# Altium schematic sheet LCD_PCB_schemetic_1.SchDoc
size A4; SheetNumber: 1; SheetTotal: 1
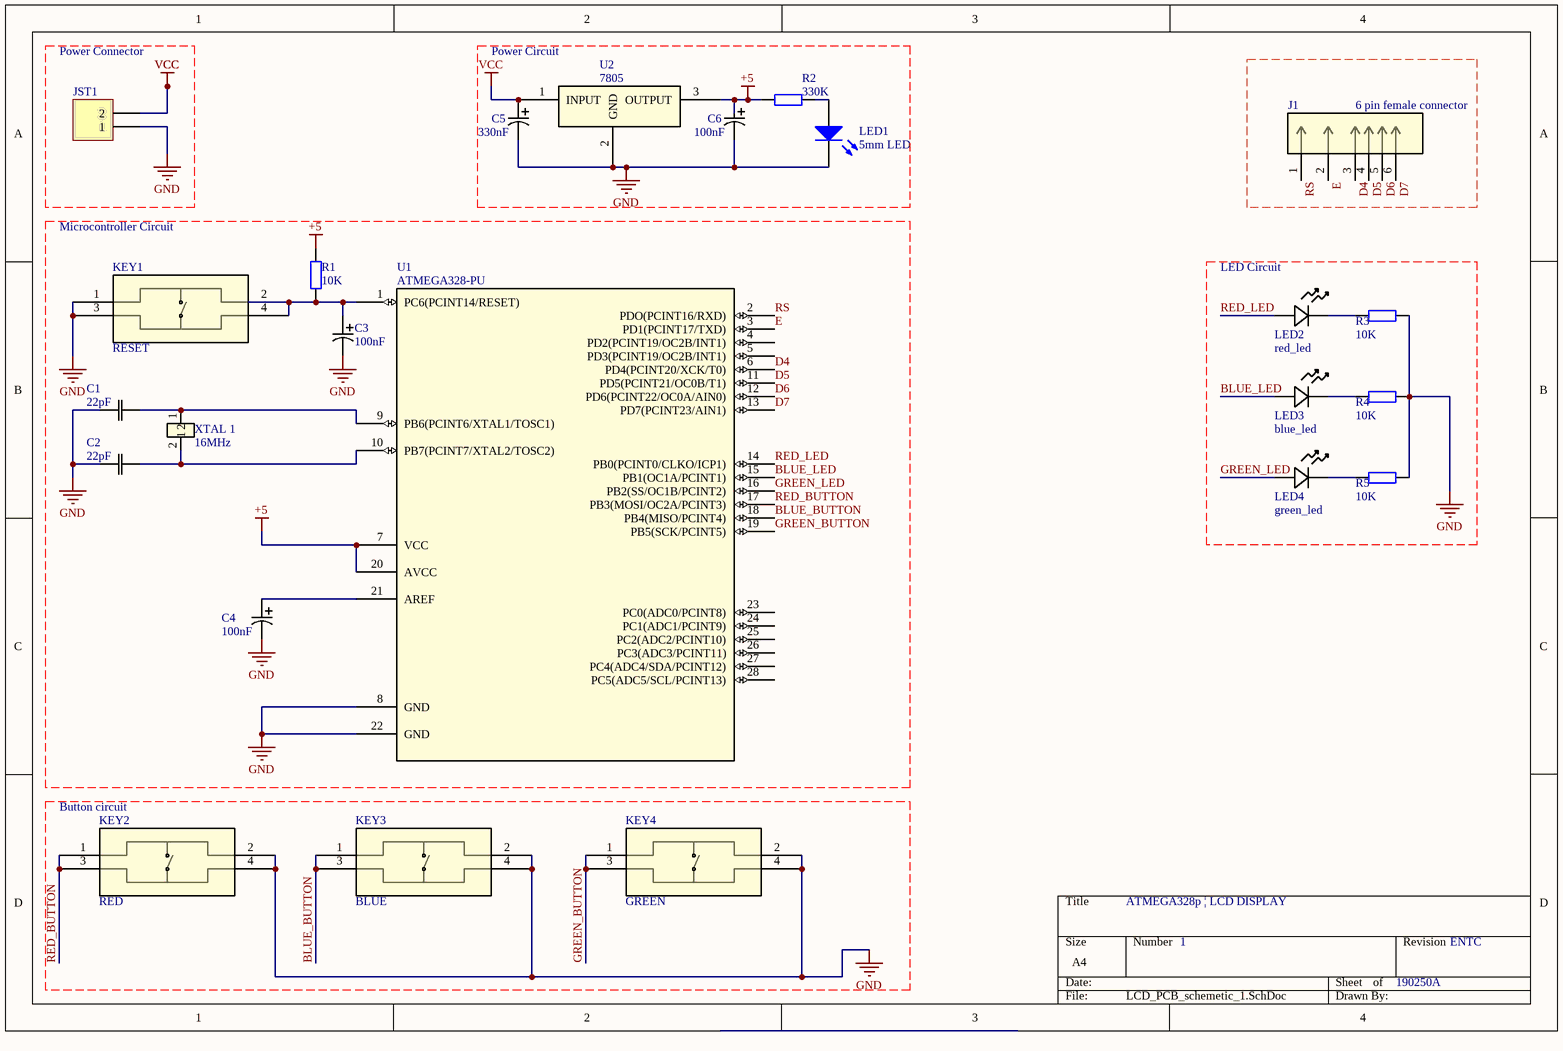
[diagram p0: LCD_PCB_schemetic_1.SchDoc]

## Parts
C1  22pF  [CAP_K220J15C0GF53L2_VIS]
C2  22pF  [CAP_K220J15C0GF53L2_VIS]
C3  100nF  [PCAP_10x16_PAN]
C4  100nF  [PCAP_10x16_PAN]
C5  330nF  [PCAP_10x16_PAN]
C6  100nF  [PCAP_10x16_PAN]
J1  6 pin female connector  [CONN6_1744055-6]
JST1  (no value)  [MHDR1X2]
KEY1  RESET  [TL1100F]
KEY2  RED  [TL1100F]
KEY3  BLUE  [TL1100F]
KEY4  GREEN  [TL1100F]
LED1  5mm LED  [LED-0]
LED2  red_led  [LED_SSL-LX5093BID_LUM]
LED3  blue_led  [LED_SSL-LX5093BID_LUM]
LED4  green_led  [LED_SSL-LX5093BID_LUM]
R1  10K  [AXIAL-0.4]
R2  330K  [AXIAL-0.4]
R3  10K  [AXIAL-0.4]
R4  10K  [AXIAL-0.4]
R5  10K  [AXIAL-0.4]
U1  ATMEGA328-PU  [28P3_SPDIP28_SP_MCH]
U2  7805  [TO-220_FAS]
XTAL_1  16MHz  [SMD_ABLS_11P4X4P7_ABR]

## Nets
+5: C6.1 R1.2 R2.1 U1.7(VCC) U1.20(AVCC) U2.3(OUTPUT)
GND: C1.2 C2.2 C3.2 C4.2 C5.2 C6.2 JST1.1 KEY1.1 KEY1.3 KEY2.2 KEY2.4 KEY3.2 KEY3.4 KEY4.2 KEY4.4 LED1.2(K) R3.1 R4.1 R5.1 U1.8(GND) U1.22(GND) U2.2(GND)
VCC: C5.1 JST1.2 U2.1(INPUT)
BLUE_BUTTON: KEY3.1 KEY3.3 U1.18(PB4(MISO/PCINT4))
BLUE_LED: LED3.2 U1.15(PB1(OC1A/PCINT1))
D4: J1.3 U1.6(PD4(PCINT20/XCK/T0))
D5: J1.4 U1.11(PD5(PCINT21/OC0B/T1))
D6: J1.5 U1.12(PD6(PCINT22/OC0A/AIN0))
D7: J1.6 U1.13(PD7(PCINT23/AIN1))
E: J1.2 U1.3(PD1(PCINT17/TXD))
GREEN_BUTTON: KEY4.1 KEY4.3 U1.19(PB5(SCK/PCINT5))
GREEN_LED: LED4.2 U1.16(PB2(SS/OC1B/PCINT2))
RED_BUTTON: KEY2.1 KEY2.3 U1.17(PB3(MOSI/OC2A/PCINT3))
RED_LED: LED2.2 U1.14(PB0(PCINT0/CLKO/ICP1))
RS: J1.1 U1.2(PDO(PCINT16/RXD))
NetC1_1: C1.1 U1.9(PB6(PCINT6/XTAL1/TOSC1)) XTAL_1.1
NetC2_1: C2.1 U1.10(PB7(PCINT7/XTAL2/TOSC2)) XTAL_1.2
NetC3_1: C3.1 KEY1.2 KEY1.4 R1.1 U1.1(PC6(PCINT14/RESET))
NetC4_1: C4.1 U1.21(AREF)
NetLED1_1: LED1.1(A) R2.2
NetLED2_1: LED2.1 R3.2
NetLED3_1: LED3.1 R4.2
NetLED4_1: LED4.1 R5.2

Not connected (* = marked no-connect by the designer): U1 4(PD2(PCINT19/OC2B/INT1)) 5(PD3(PCINT19/OC2B/INT1)) 23(PC0(ADC0/PCINT8)) 24(PC1(ADC1/PCINT9)) 25(PC2(ADC2/PCINT10)) 26(PC3(ADC3/PCINT11)) 27(PC4(ADC4/SDA/PCINT12)) 28(PC5(ADC5/SCL/PCINT13))

## Notes on the sheet
- Power Connector
- Power Circuit
- Microcontroller Circuit
- (near LED2) LED Circuit
- (near KEY2) Button circuit
- ATMEGA328p | LCD DISPLAY
- 1
- 190250A
- ENTC

## Library data of the parts
C1 C2 = K220J15C0GF53L2: No Description Available; Vendor: Vishay; Built_By: EMA_Cory; SourceLibrary: Vishay_2020-06-24; Type: DEV; Datasheet: https://www.mouser.com/datasheet/2/427/kseries-1763315.pdf; Manufacturer_Part_Number: K220J15C0GF53L2; Copyright: Copyright (C) 2018 Accelerated Designs. All rights reserved; RefDes: RefDes
C3-C6 = ECA2GM4R7: No Description Available; Vendor: Panasonic; Built_By: EMA_UL_Team; SourceLibrary: Panasonic_2011-12-05_Caps_NHG; Type: DEV; Manufacturer_Part_Number: ECA2GM4R7; Copyright: Copyright (C) 2018 Accelerated Designs. All rights reserved; RefDes: RefDes
J1 = 1744055-6: 3.96 EP HDR ASSY 6P VERT HT; Vendor: TE Connectivity; Built_By: EMA_UL_Team; ROWS/CONFIG: 1; PITCH(MM): 3.96; POSITIONS: 6; SourceLibrary: TE_Connectivity_250_Part_Delivery_6_2018-09-18; Copyright: Copyright (C) 2016 Accelerated Designs. All rights reserved; Manufacturer_Part_Number: 1744055-6; TE_Part_Number: 1744055-6; PRODUCT: Connector; Type: DEV; Datasheet: https://www.te.com/commerce/DocumentDelivery/DDEController?Action=srchrtrv&DocNm=1744055&DocType=Customer+Drawing&DocLang=English&DocFormat=pdf&PartCntxt=1744055-2; RefDes: RefDes
JST1 = MHDR1X2: Header, 2-Pin; LatestRevisionDate: 17-Jul-2002; LatestRevisionNote: Re-released for DXP Platform.; Publisher: Altium Limited
KEY1-KEY4 = TL1100FF160Q: No Description Available; Vendor: E-Switch; Built_By: EMA_Cory; SourceLibrary: E-Switch_2020-03-31; Datasheet: https://sten-eswitch-13110800-production.s3.amazonaws.com/system/asset/product_line/data_sheet/143/TL1100.pdf; Manufacturer_Part_Number: TL1100FF160Q; Copyright: Copyright (C) 2018 Accelerated Designs. All rights reserved; RefDes: RefDes; Type: DEV
LED1 = LED0: Typical INFRARED GaAs LED; Published: 8-Jun-2000; LatestRevisionDate: 08-Jul-2005; LatestRevisionNote: Mech Layer 1 removed.; PackageReference: LED-0; Publisher: Altium Limited; PackageDescription: LED; 2 Leads
LED2-LED4 = SSL-LX5093BID: No Description Available; Vendor: Lumex; Built_By: EMA_Cory; SourceLibrary: Add_to_database_2021-04-19; Type: DEV; Datasheet: https://www.mouser.com/datasheet/2/244/SSL-LX5093BID-1137540.pdf; Manufacturer_Part_Number: SSL-LX5093BID; Copyright: Copyright (C) 2018 Accelerated Designs. All rights reserved; RefDes: RefDes
R1-R5 = Res2: Resistor; Published: 8-Jun-2000; LatestRevisionDate: 17-Jul-2002; LatestRevisionNote: Re-released for DXP Platform.; PackageReference: AXIAL-0.4; Publisher: Altium Limited; PackageDescription: Axial Device, Thru-Hole; 2 Leads; 0.4 in Pin Spacing
U1 = ATMEGA328-PU_1: No Description Available; SourceLibrary: Update_to_database_2021-05-13; Built_By: EMA_Cory; Vendor: Microchip; Datasheet: https://ww1.microchip.com/downloads/en/DeviceDoc/ATmega48A-PA-88A-PA-168A-PA-328-P-DS-DS40002061B.pdf; Copyright: Copyright (C) 2018 Accelerated Designs. All rights reserved; Manufacturer_Part_Number: ATMEGA328-PU; RefDes: RefDes; Type: DEV
U2 = LM7805CT: No Description Available; Vendor: Fairchild Semiconductor; Built_By: EMA_UL_Team; SourceLibrary: Fairchild_2008-01-01_; Manufacturer_Part_Number: LM7805CT; Copyright: Copyright (C) 2018 Accelerated Designs. All rights reserved; RefDes: RefDes; Type: DEV
XTAL_1 = ABLS-16.000MHZ-B4-T: No Description Available; Vendor: Abracon; Built_By: EMA_Anthony; SourceLibrary: Add_to_database_2021-04-09; Datasheet: https://abracon.com/Resonators/abls.pdf; Copyright: Copyright (C) 2018 Accelerated Designs. All rights reserved; Manufacturer_Part_Number: ABLS-16.000MHZ-B4-T; RefDes: RefDes; Type: DEV